# EAGLE schematic edge_card_slot_protototype_schematic (EAGLE 7.6.0)
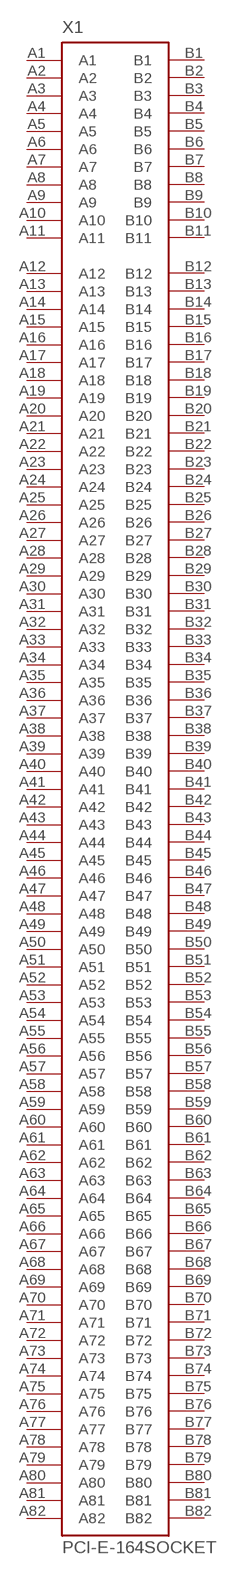
[diagram p0: schematic, sheet 1]

## Parts
X1  PCI-E-164SOCKET  [PCI-E-164]
Unconnected: X1.A1 X1.A2 X1.A3 X1.A4 X1.A5 X1.A6 X1.A7 X1.A8 X1.A9 X1.A10 X1.A11 X1.A12 X1.A13 X1.A14 X1.A15 X1.A16 X1.A17 X1.A18 X1.A19 X1.A20 X1.A21 X1.A22 X1.A23 X1.A24 X1.A25 X1.A26 X1.A27 X1.A28 X1.A29 X1.A30 X1.A31 X1.A32 X1.A33 X1.A34 X1.A35 X1.A36 X1.A37 X1.A38 X1.A39 X1.A40 X1.A41 X1.A42 X1.A43 X1.A44 X1.A45 X1.A46 X1.A47 X1.A48 X1.A49 X1.A50 X1.A51 X1.A52 X1.A53 X1.A54 X1.A55 X1.A56 X1.A57 X1.A58 X1.A59 X1.A60 X1.A61 X1.A62 X1.A63 X1.A64 X1.A65 X1.A66 X1.A67 X1.A68 X1.A69 X1.A70 X1.A71 X1.A72 X1.A73 X1.A74 X1.A75 X1.A76 X1.A77 X1.A78 X1.A79 X1.A80 X1.A81 X1.A82 X1.B1 X1.B2 X1.B3 X1.B4 X1.B5 X1.B6 X1.B7 X1.B8 X1.B9 X1.B10 X1.B11 X1.B12 X1.B13 X1.B14 X1.B15 X1.B16 X1.B17 X1.B18 X1.B19 X1.B20 X1.B21 X1.B22 X1.B23 X1.B24 X1.B25 X1.B26 X1.B27 X1.B28 X1.B29 X1.B30 X1.B31 X1.B32 X1.B33 X1.B34 X1.B35 X1.B36 X1.B37 X1.B38 X1.B39 X1.B40 X1.B41 X1.B42 X1.B43 X1.B44 X1.B45 X1.B46 X1.B47 X1.B48 X1.B49 X1.B50 X1.B51 X1.B52 X1.B53 X1.B54 X1.B55 X1.B56 X1.B57 X1.B58 X1.B59 X1.B60 X1.B61 X1.B62 X1.B63 X1.B64 X1.B65 X1.B66 X1.B67 X1.B68 X1.B69 X1.B70 X1.B71 X1.B72 X1.B73 X1.B74 X1.B75 X1.B76 X1.B77 X1.B78 X1.B79 X1.B80 X1.B81 X1.B82

## Library data of the parts
X1 = con-pc:PCI-E-164: Copy from con-pci_express(pci-e).lbr uploaded Mon Jul 2 10:15:25 2007 Library for PCI-Express x16 (PCI-E) connector. Includes connector and card edge pattern. Uploaded by JF Duval <jfduval@aqra.ca> from AQRA.ca